# Altium schematic sheet 12V6_Boost.SchDoc: 12V6 Boost circuit
size 431 x 279 mm; Date: 02/15/2021; DrawnBy: Team Koin; Organization: University of Pennsylvania; DocumentNumber: 5; Revision: 2; SheetNumber: 6; SheetTotal: 9
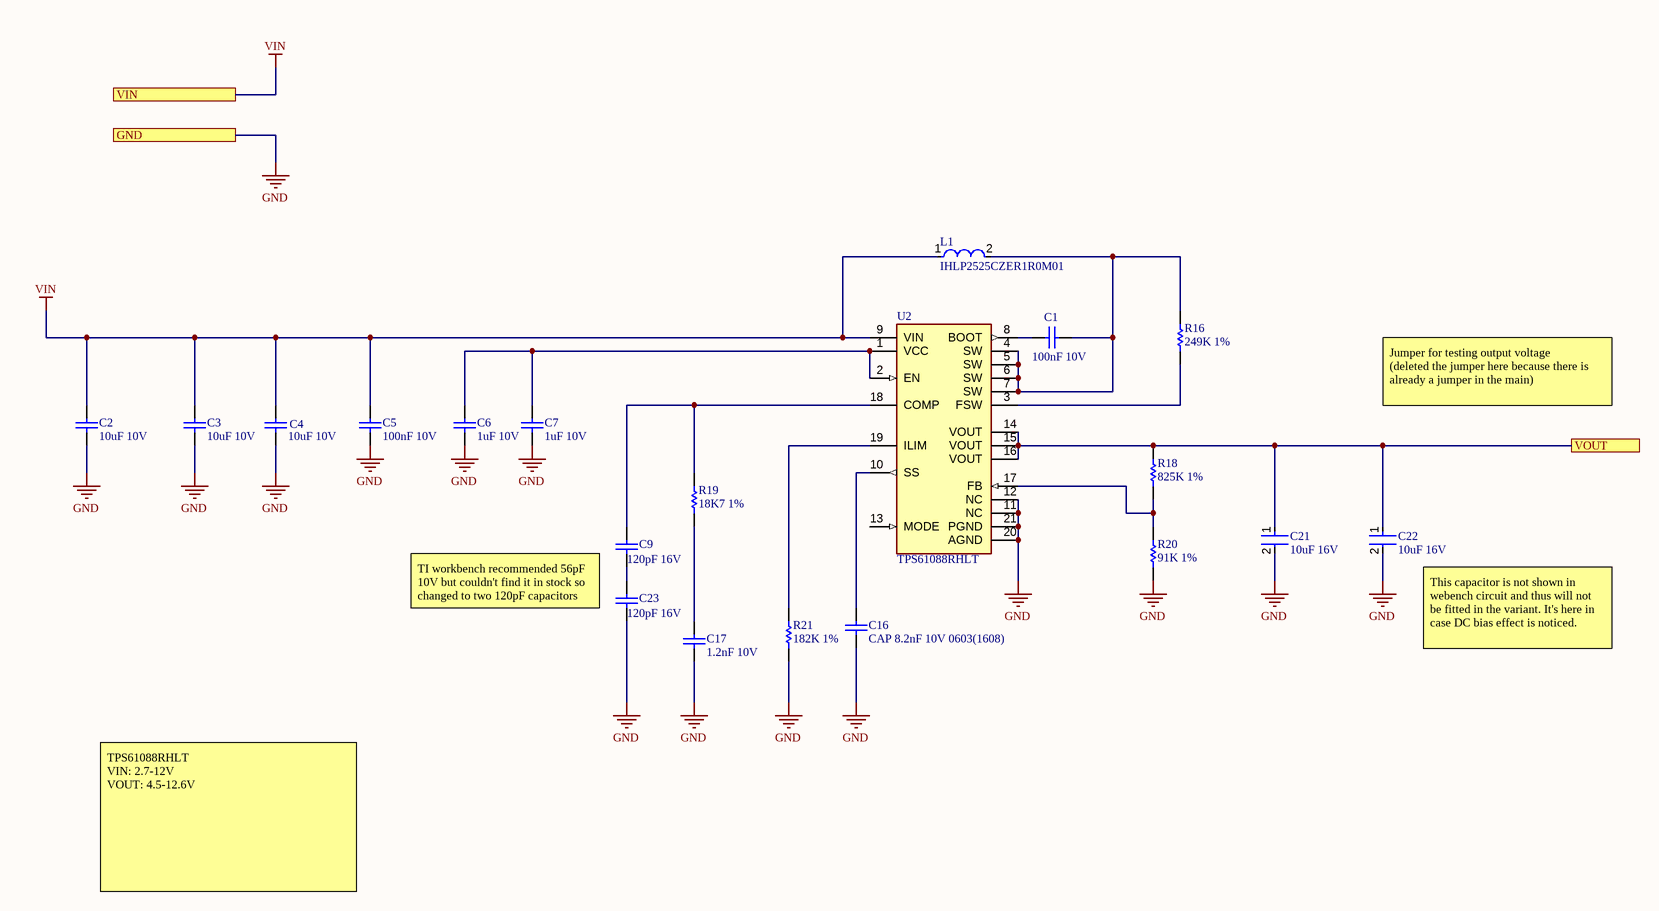
[diagram p0: 12V6_Boost.SchDoc]

## Parts
C1  100nF 10V  [CAPC0603(1608)100_L]
C2  10uF 10V  [CAPC0603(1608)100_N]
C3  10uF 10V  [CAPC0603(1608)100_N]
C4  10uF 10V  [CAPC0603(1608)100_N]
C5  100nF 10V  [CAPC0603(1608)100_L]
C6  1uF 10V  [CAPC0603(1608)100_M]
C7  1uF 10V  [CAPC0603(1608)100_M]
C9  120pF 16V  [CAPC0402(1005)60_N]
C16  CAP 8.2nF 10V 0603(1608)  [CAPC0603(1608)100_N]
C17  1.2nF 10V  [CAPC0603(1608)100_L]
C21  10uF 16V  [FP-CL21-IPC_B]
C22  10uF 16V  [FP-CL21-IPC_B]
C23  120pF 16V  [CAPC0402(1005)60_N]
L1  IHLP2525CZER1R0M01  [FP-IHLP-2525CZ-FP_2_413x3-MFG]
R16  249K 1%  [RESC0603(1608)_L]
R18  825K 1%  [RESC0402(1005)_N]
R19  18K7 1%  [RESC0603(1608)_L]
R20  91K 1%  [RESC0402(1005)_M]
R21  182K 1%  [RESC0603(1608)_L]
U2  TPS61088RHLT  [FP-RHL0020A-MFG]

## Ports
GND, VIN, VOUT

## Nets
GND: C2.1 C3.1 C4.1 C5.1 C6.1 C7.1 C16.2 C17.1 C21.2 C22.2 C23.1 R20.1 R21.1 U2.11(NC) U2.12(NC) U2.20(AGND) U2.21(PGND) ; port GND
VIN: C2.2 C3.2 C4.2 C5.2 L1.1 U2.9(VIN) ; port VIN
VOUT: C21.1 C22.1 R18.2 U2.14(VOUT) U2.15(VOUT) U2.16(VOUT) ; port VOUT
NetC1_1: C1.1 L1.2 R16.2 U2.4(SW) U2.5(SW) U2.6(SW) U2.7(SW)
NetC1_2: C1.2 U2.8(BOOT)
NetC6_2: C6.2 C7.2 U2.1(VCC) U2.2(EN)
NetC9_1: C9.1 C23.2
NetC9_2: C9.2 R19.2 U2.18(COMP)
NetC16_1: C16.1 U2.10(SS)
NetC17_2: C17.2 R19.1
NetR16_1: R16.1 U2.3(FSW)
NetR18_1: R18.1 R20.2 U2.17(FB)
NetR21_2: R21.2 U2.19(ILIM)

Not connected (* = marked no-connect by the designer): U2 13(MODE)

## Notes on the sheet
- Jumper for testing output voltage
  (deleted the jumper here because there is already a jumper in the main)
- TI workbench recommended 56pF 10V but couldn't find it in stock so changed to two 120pF capacitors
- (near C22) This capacitor is not shown in webench circuit and thus will not be fitted in the variant. It's here in case DC bias effect is noticed.
- TPS61088RHLT
  VIN: 2.7-12V
  VOUT: 4.5-12.6V
- DWG. NO.
- REV.
- SHT.
- THIS DOCUMENT AND THE DATA DISCLOSED HEREIN OR HEREWITH IS THE PROPERTY OF ALTIUM LIMITED AND MAY BE FREELY DISTRIBUTED IN WHOLE. NO RIGHTS ARE RESERVED OR EXPRESS OR IMPLIED WARANTEE GIVEN.
- REVISION
- DESCRIPTION
- DATE
- APPROVED
- ENG:
- APPROVALS
- PROJECT
- DSN:
- CHK:
- REFERENCE DOCUMENTS
- PROJECT REVISION:
- TITLE
- DOCUMENT REVISION:
- DESIGN ITEM:
- BOM:
- FAB DWG:
- PCB DWG:
- ASSY DWG:
- SCALE:
- SIZE
- B
- CAGE CODE
- FILE NAME
- DWG NO.
- SHEET
- OF
- REV

## Library data of the parts
C1 = CMP-1035-02579-1: CAP 100nF 10V ±5% 0603 (1608 Metric) Thickness 1mm SMD; Tolerance: Â±5%; Case-EIA: 0603; Case-Metric: 1608; Value: 100nF; Max Thickness: 1 mm; Rated Voltage: 10 V; Technology: SMT
C2-C4 = CMP-1035-02799-1: CAP 10uF 10V ±10% 0603 (1608 Metric) Thickness 1mm SMD; Tolerance: Â±10%; Case-Metric: 1608; Case-EIA: 0603; Max Thickness: 1 mm; Technology: SMT; Rated Voltage: 10 V; Value: 10uF
C5 = CMP-1035-02579-1: Tolerance: Â±5%; Case-EIA: 0603; Case-Metric: 1608; Value: 100nF; Max Thickness: 1 mm; Rated Voltage: 10 V; Technology: SMT
C6 C7 = CMP-1035-02733-1: CAP 1uF 10V ±10% 0603 (1608 Metric) Thickness 1mm SMD; Tolerance: Â±10%; Case-EIA: 0603; Case-Metric: 1608; Rated Voltage: 10 V; Max Thickness: 1 mm; Value: 1uF; Technology: SMT
C9 C23 = CMP-1034-01262-1: CAP 120pF 16V ±1% 0402 (1005 Metric) Thickness 0.6mm SMD; Case-Metric: 1005; Case-EIA: 0402; Tolerance: Â±1%; Max Thickness: 0.6 mm; Value: 120pF; Rated Voltage: 16 V; Technology: SMT
C16 = CMP-1035-02280-1: CAP 8.2nF 10V ±5% 0603 (1608 Metric) Thickness 1mm SMD; Tolerance: Â±5%; Case-Metric: 1608; Case-EIA: 0603; Max Thickness: 1 mm; Technology: SMT; Rated Voltage: 10 V; Value: 8.2nF
C17 = CMP-1035-01909-1: CAP 1.2nF 10V ±1% 0603 (1608 Metric) Thickness 1mm SMD; Case-EIA: 0603; Case-Metric: 1608; Tolerance: Â±1%; Rated Voltage: 10 V; Technology: SMT; Value: 1.2nF; Max Thickness: 1 mm
C21 C22 = CMP-13271-003194-1: CL21 Series 0805 10uF 16V ±10% Tolerance X5R Multilayer Ceramic Chip Capacitor; Case Code (Imperial): 0805; Max Operating Temperature: 85°C; Capacitance: 10uF; Min Operating Temperature: -55°C; Thickness: 0.053inch; Tolerance: 10%; Dielectric: X5R; Radiation Hardening: No; Height: 1.25mm; Packaging: Tape and Reel; Case/Package: 0805; Width: 0.049inch; Package Quantity: 2000; Voltage Rating: 16V; Depth: 1.25mm; Length: 2mm; Case Code (Metric): 2012; Mount: Surface Mount
L1 = CMP-02424-000599-1: Commercial Inductors, High Saturation Series 1uH 11A 10mΩ 20%; Self Resonant Frequency: 5MHz; Test Frequency: 100kHz; Shielding: Shielded; Core Material: Metal; Saturation Current: 22A; DC Resistance (DCR): 10mR; Current Rating: 11A; Packaging: Tape and Reel; Width: 6.47mm; Number of Pins: 2; Case/Package: 2525; Termination: SMD/SMT; Length: 7.24mm; Height: 3mm; Min Operating Temperature: -55°C; Mount: Surface Mount; Inductance Tolerance: 20%; Max Operating Temperature: 125°C; Military Standard: Not; Max DC Current: 11A; RMS Current (Irms): 11A; Lead Free: Lead Free; Depth: 6.72mm; Tolerance: 20%; Package Quantity: 2000; Radiation Hardening: No; Contact Plating: Tin; Inductance: 1uH
R16 = CMP-1012-00779-1: 249K 0.1W 1% 0603 (1608 Metric)  SMD; Case-Metric: 1608; Case-EIA: 0603; Value: 249000.00 Ohm; Technology: SMT; Power: 0.1 W; Tolerance: 1 %
R18 = CMP-1011-00840-1: 825K 0.063W 1% 0402 (1005 Metric)  SMD; Value: 825000.00 Ohm; Case-Metric: 1005; Case-EIA: 0402; Tolerance: 1 %; Power: 0.063 W; Technology: SMT
R19 = CMP-1012-00652-1: 18K7 0.1W 1% 0603 (1608 Metric)  SMD; Value: 18700.00 Ohm; Case-EIA: 0603; Case-Metric: 1608; Technology: SMT; Power: 0.1 W; Tolerance: 1 %
R20 = CMP-1011-00732-1: 91K 0.063W 1% 0402 (1005 Metric)  SMD; Value: 91000.00 Ohm; Case-EIA: 0402; Case-Metric: 1005; Technology: SMT; Power: 0.063 W; Tolerance: 1 %
R21 = CMP-1012-00764-1: 182K 0.1W 1% 0603 (1608 Metric)  SMD; Case-EIA: 0603; Value: 182000.00 Ohm; Case-Metric: 1608; Power: 0.1 W; Technology: SMT; Tolerance: 1 %
U2 = CMP-04918-000117-1: IC REG BOOST ADJ 10A 20VQFN; Manufacturer: Texas Instruments; Output Voltage: 4.5-12.6V; Max Junction Temp: +125°C; Max Duty Cycle: 90%; Output Type: AdjustableProgrammable; Nominal Supply Current: 1-110uA; Min Supply Voltage: 2.7V; Switching Frequency: 200-2200kHz; Number Of Outputs: 1; Max Supply Voltage: 12V; Manufacturer Part Number: TPS61088RHLT; Digikey Description: IC REG BOOST ADJ 10A 20VQFN; Octopart: https://octopart.com/tps61088rhlt-texas+instruments-57155059; Switching Topology: Boost; Lead Free: Yes; Output Current: 10A; Height: 1mm; Temperature: -40°C to +85°C; Package: RHL0020A; Device Class L3: Voltage Regulators - Switching; RoHS: TRUE; Temperature Range Low: -40°C; Temperature Range High: +85°C; Device Class L1: Integrated Circuits (ICs); Automotive: No; Category: IC; ComponentLink2Description: Datasheet; ComponentLink2URL: http://www.ti.com/lit/ds/symlink/tps61088.pdf; Device Class L2: Power Management ICs